# EAGLE design main (EAGLE 8.0.2)
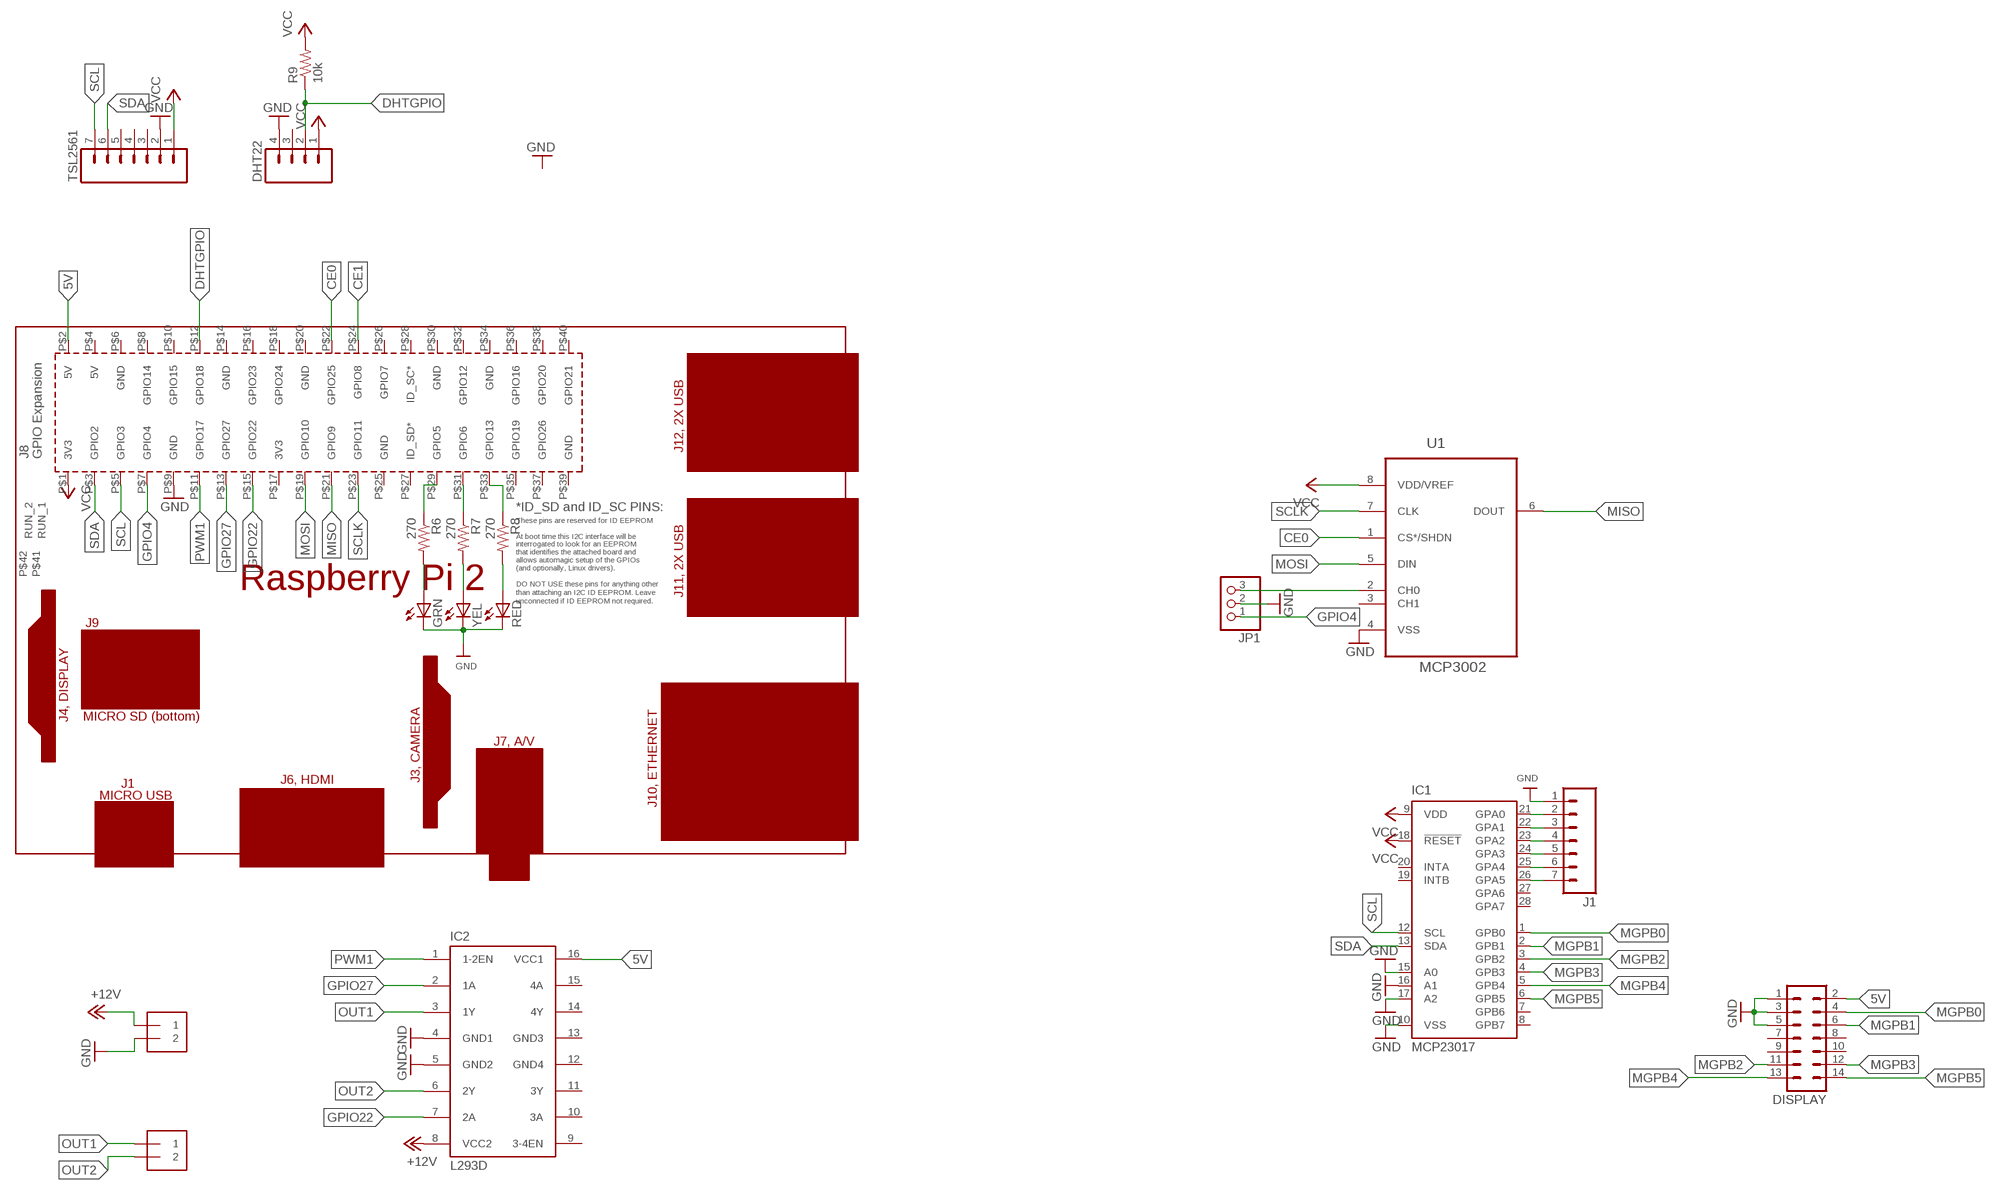
[diagram p0: schematic, sheet 1]

## Parts
DHT22  M041X04_NO_SILK  [1X04_NO_SILK]
DISPLAY  MA07-2  [MA07-2]
GRN  LED3MM  [LED3MM]
IC1  MCP23017  MCP23017SP2  [DIL28-3-ROUND]
IC2  L293D  [DIL16]
J1  M07  [1X07]
J2  1X2-3.5MM  [1X2-3.5MM]
J3  1X2-3.5MM  [1X2-3.5MM]
JP1  PINHD-1X3  [1X03]
PCB1  RPI2  [RPI2]
R6  270  R-US_0204/7  [0204/7]
R7  270  R-US_0204/7  [0204/7]
R8  270  R-US_0204/7  [0204/7]
R9  10k  R-US_0204/7  [0204/7]
RED  LED3MM  [LED3MM]
TSL2561  M07NO_SILK  [1X07_NO_SILK]
U1  MCP3002  MCP3002-I/P  [DIP254P762X533-8]
YEL  LED3MM  [LED3MM]

## Nets
5V: DISPLAY.2 IC2.16(VCC1) PCB1.P$2(5V)
+12V: IC2.8(VCC2) J2.1
CE0: PCB1.P$22(GPIO25) U1.1(CS*/SHDN)
CE1: PCB1.P$24(GPIO8)
DHTGPIO: DHT22.2 PCB1.P$12(GPIO18) R9.1
GND: DHT22.4 DISPLAY.1 DISPLAY.3 DISPLAY.5 GRN.K(C) IC1.10(VSS) IC1.15(A0) IC1.16(A1) IC1.17(A2) IC2.4(GND1) IC2.5(GND2) J1.1 J2.2 JP1.2 PCB1.P$9(GND) RED.K(C) TSL2561.2 U1.4(VSS) YEL.K(C)
GPIO4: JP1.1 PCB1.P$7(GPIO4)
GPIO5: PCB1.P$29(GPIO5) R6.1
GPIO6: PCB1.P$31(GPIO6) R7.1
GPIO13: PCB1.P$33(GPIO13) R8.1
GPIO22: IC2.7(2A) PCB1.P$15(GPIO22)
GPIO27: IC2.2(1A) PCB1.P$13(GPIO27)
MGPB0: DISPLAY.4 IC1.1(GPB0)
MGPB1: DISPLAY.6 IC1.2(GPB1)
MGPB2: DISPLAY.11 IC1.3(GPB2)
MGPB3: DISPLAY.12 IC1.4(GPB3)
MGPB4: DISPLAY.13 IC1.5(GPB4)
MGPB5: DISPLAY.14 IC1.6(GPB5)
MISO: PCB1.P$21(GPIO9) U1.6(DOUT)
MOSI: PCB1.P$19(GPIO10) U1.5(DIN)
N$1: IC1.26(GPA5) J1.7
N$2: IC1.25(GPA4) J1.6
N$3: IC1.24(GPA3) J1.5
N$4: IC1.23(GPA2) J1.4
N$5: IC1.22(GPA1) J1.3
N$6: JP1.3 U1.2(CH0)
N$7: IC1.21(GPA0) J1.2
N$18: GRN.A R6.2
N$19: R7.2 YEL.A
N$20: R8.2 RED.A
OUT1: IC2.3(1Y) J3.1
OUT2: IC2.6(2Y) J3.2
PWM1: IC2.1(1-2EN) PCB1.P$11(GPIO17)
SCL: IC1.12(SCL) PCB1.P$5(GPIO3) TSL2561.7
SCLK: PCB1.P$23(GPIO11) U1.7(CLK)
SDA: IC1.13(SDA) PCB1.P$3(GPIO2) TSL2561.6
VCC: DHT22.1 IC1.9(VDD) IC1.18(!RESET) PCB1.P$1(3V3) R9.2 TSL2561.1 U1.8(VDD/VREF)
Unconnected: DHT22.3 DISPLAY.7 DISPLAY.8 DISPLAY.9 DISPLAY.10 IC1.7(GPB6) IC1.8(GPB7) IC1.19(INTB) IC1.20(INTA) IC1.27(GPA6) IC1.28(GPA7) IC2.9(3-4EN) IC2.10(3A) IC2.11(3Y) IC2.14(4Y) IC2.15(4A) PCB1.P$4(5V) PCB1.P$6(GND) PCB1.P$8(GPIO14) PCB1.P$10(GPIO15) PCB1.P$14(GND) PCB1.P$16(GPIO23) PCB1.P$17(3V3) PCB1.P$18(GPIO24) PCB1.P$20(GND) PCB1.P$25(GND) PCB1.P$26(GPIO7) PCB1.P$27(ID_SD*) PCB1.P$28(ID_SC*) PCB1.P$30(GND) PCB1.P$32(GPIO12) PCB1.P$34(GND) PCB1.P$35(GPIO19) PCB1.P$36(GPIO16) PCB1.P$37(GPIO26) PCB1.P$38(GPIO20) PCB1.P$39(GND) PCB1.P$40(GPIO21) PCB1.P$41(RUN_1) PCB1.P$42(RUN_2) TSL2561.3 TSL2561.4 TSL2561.5 U1.3(CH1)

## Power pins joined to a net without a drawn wire
GND3: IC2.13(GND3)
GND4: IC2.12(GND4)

## Library data of the parts
DHT22 = SparkFun-Connectors:M04: Header 4 Standard 4-pin 0.1" header. Use with straight break away headers (SKU : PRT-00116), right angle break away headers (PRT-00553), swiss pins (PRT-00743), machine pins (PRT-00117), and female headers (PRT-00115). Molex polarized connector foot print use with SKU : PRT-08231 with associated crimp pins and housings. 1MM SMD Version SKU: PRT-10208; PROD_ID: CONN-09696
DISPLAY = con-lstb:MA07-2: PIN HEADER; OC_FARNELL: unknown; OC_NEWARK: unknown
GRN RED YEL = adafruit:LED: LED OSRAM: - CHIPLED LG R971, LG N971, LY N971, LG Q971, LY Q971, LO R971, LY R971 LH N974, LH R974 LS Q976, LO Q976, LY Q976 LO Q996 - Hyper CHIPLED LW Q18S LB Q993, LB Q99A, LB R99A - SideLED LS A670, LO A670, LY A670, LG A670, LP A670 LB A673, LV A673, LT A673, LW A673 LH A674 LY A675 LS A676, LA A676, LO A676, LY A676, LW A676 LS A679, LY A679, LG A679 - Hyper Micro SIDELED® LS Y876, LA Y876, LO Y876, LY Y876 LT Y87S - SmartLED LW L88C, LW L88S LB L89C, LB L89S, LG L890 LS L89K, LO L89K, LY L89K LS L896, LA L896, LO L896, LY L896 - TOPLED LS T670, LO T670, LY T670, LG T670, LP T670 LSG T670, LSP T670, LSY T670, LOP T670, LYG T670 LG T671, LOG T671, LSG T671 LB T673, LV T673, LT T673, LW T673 LH T674 LS T676, LA T676, LO T676, LY T676, LB T676, LH T676, LSB T676, LW T676 LB T67C, LV T67C, LT T67C, LS T67K, LO T67K, LY T67K, LW E67C LS E67B, LA E67B, LO E67B, LY E67B, LB E67C, LV E67C, LT E67C LW T67C LS T679, LY T679, LG T679 LS T770, LO T770, LY T770, LG T770, LP T770 LB T773, LV T773, LT T773, LW T773 LH T774 LS E675, LA E675, LY E675, LS T675 LS T776, LA T776, LO T776, LY T776, LB T776 LHGB T686 LT T68C, LB T68C - Hyper Mini TOPLED® LB M676 - Mini TOPLED Santana® LG M470 LS M47K, LO M47K, LY M47K Source: http://www.osram.convergy.de/
IC1 = adafruit:MCP23017: http://ww1.microchip.com/downloads/en/DeviceDoc/21952a.pdf Source: http://ww1.microchip.com/downloads/en/DeviceDoc/21952a.pdf
IC2 = st-microelectronics:L293D: PUSH-PULL 4 CHANNEL DRIVER; MPN: L293D; OC_FARNELL: 9589619; OC_NEWARK: 56P8249
J1 TSL2561 = SparkFun-Connectors:M07: Header 7 Standard 7-pin 0.1" header. Use with straight break away headers (SKU : PRT-00116), right angle break away headers (PRT-00553), swiss pins (PRT-00743), machine pins (PRT-00117), and female headers (PRT-00115). NOTES ON THE VARIANTS LOCK and LOCK_LONGPADS... This footprint was designed to help hold the alignment of a through-hole component (i.e. 7-pin header) while soldering it into place. You may notice that each hole has been shifted either up or down by 0.005 of an inch from it's more standard position (which is usually a perfectly straight line). This slight alteration caused the pins (the squares in the middle) to touch the edges of the holes. Because they are alternating, it causes a "brace" to hold the header in place. 0.005 has proven to be the perfect amount of "off-center" position when using our standard breakaway headers. Although looks a little odd when you look at the bare footprint, once you have a header in there, the alteration is very hard to notice. Also, if you push a header all the way into place, it is covered up entirely on the bottom side. This idea of altering the position of holes to aid alignment will be further integrated into the Sparkfun Library for other footprints. It can help hold any component with 3 or more connection pins.
J2 J3 = adafruit:1X2: 3.5mm Terminal block http://www.ladyada.net/library/pcb/eaglelibrary.html
JP1 = adafruit:PINHD-1X3: PIN HEADER
PCB1 = e14_Rpi2_RevA:RPI2: Device for Raspberry Pi 2 board created by www.element14.com More information and support community is available at http://www.element14.com/community/community/raspberry-pi/raspberrypi2
R6-R9 = adafruit:R-US_: RESISTOR, American symbol
U1 = mcp:MCP3002-I/P: IC, ADC, 10BIT, 200KSPS, DIP-8; MPN: MCP3002-I/P; OC_FARNELL: 1852015; OC_NEWARK: 61K2948; PACKAGE: DIP-8; SUPPLIER: Microchip

## Board
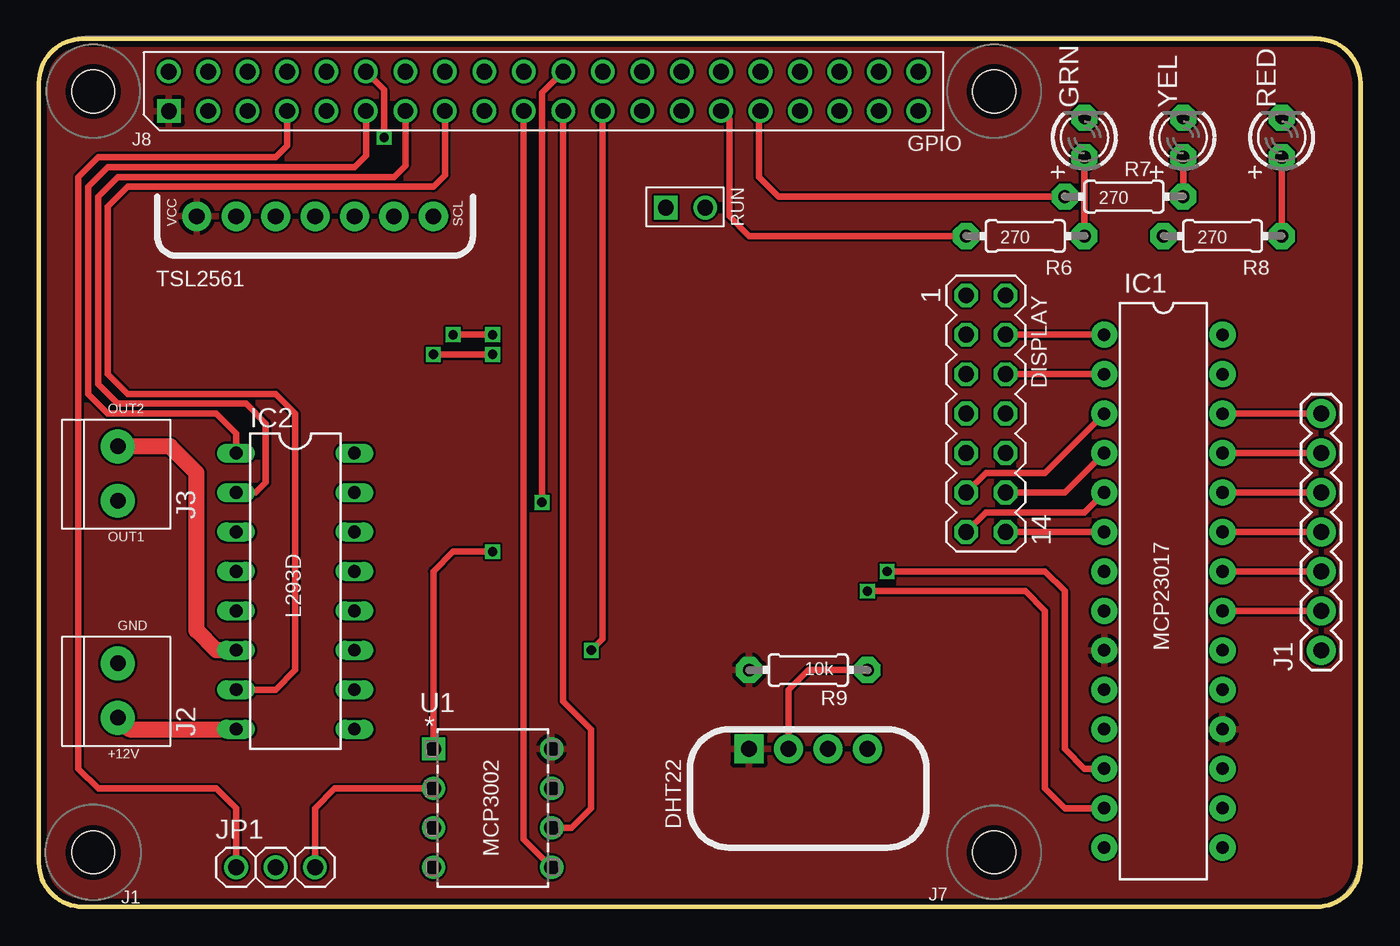
[diagram p1: board, top side]
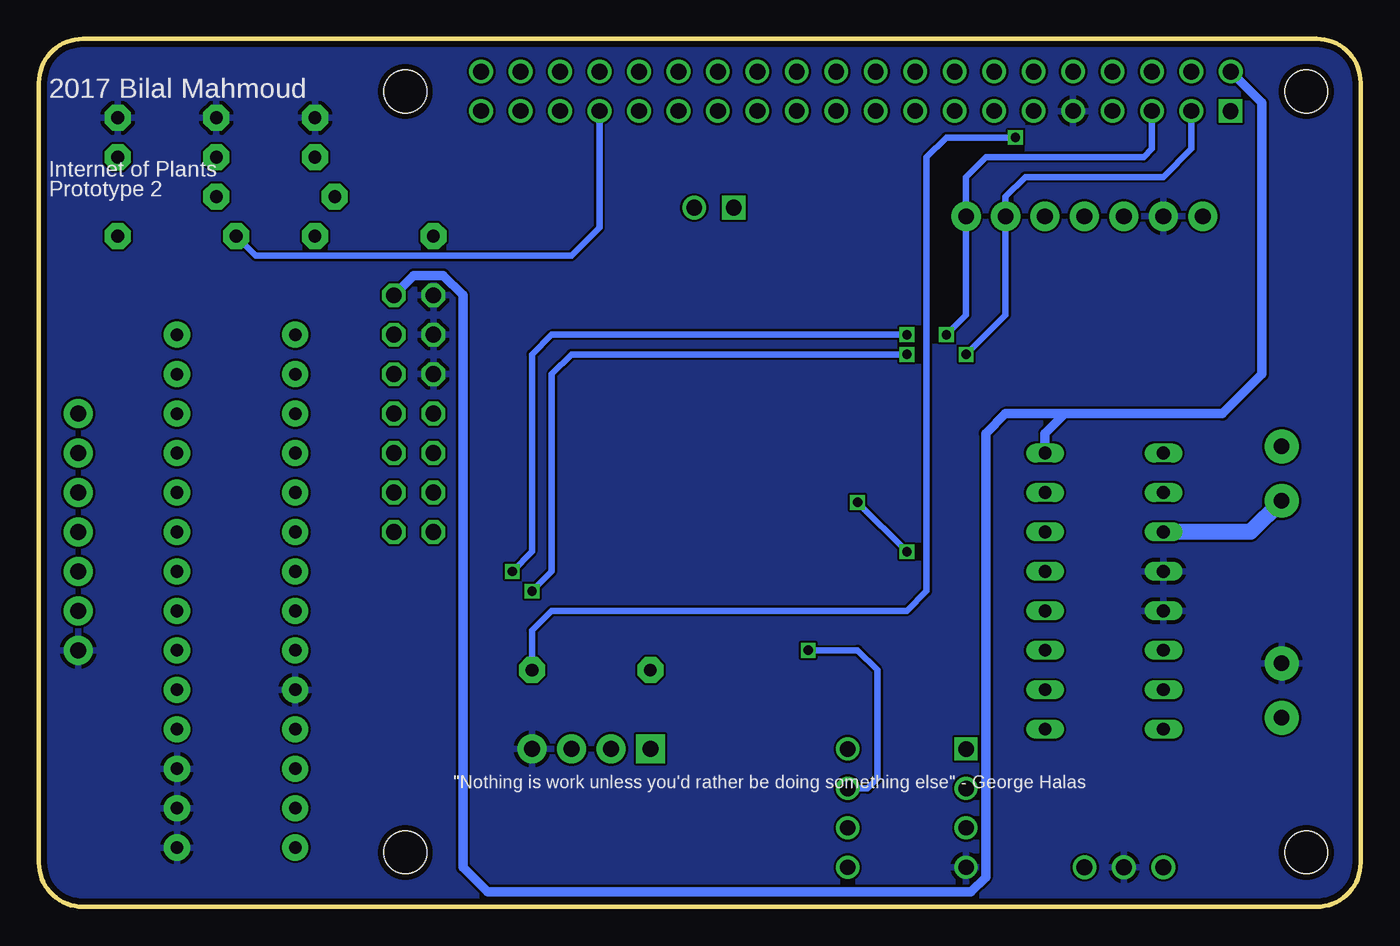
[diagram p2: board, bottom side, seen from below]

Size 85.09 x 55.88 mm. Coordinates in mm from the lower left corner, seen from the top.
Copper layers (1*16): Top 0.0356mm / dielectric 1.5011mm / Bottom 0.0356mm
Design rules "PCBs_io": minimum track width 6mil, minimum drill 13mil, track to track 6mil, track to pad 6mil, pad to pad 6mil, via to via 6mil, smd to smd 6mil, copper to edge 15mil, drill to drill 6mil, minimum pad ring 7mil, minimum via ring 7mil, stop-mask expansion 3mil, vias tented up to drill 0mil, thermal gap 10mil

### Footprints (pad centres in the part's own frame; a part is rotated, then mirrored left to right if it is on the bottom)
1X04_NO_SILK = drill 1.016 pad 1.88 square: 1 0,0 | drill 1.016 pad 1.88: 2 2.54,0; 3 5.08,0; 4 7.62,0
MA07-2 = drill 1.016 octagon: 1 -7.62,-1.27; 2 -7.62,1.27; 3 -5.08,-1.27; 4 -5.08,1.27; 5 -2.54,-1.27; 6 -2.54,1.27; 7 0,-1.27; 8 0,1.27; 9 2.54,-1.27; 10 2.54,1.27; 11 5.08,-1.27; 12 5.08,1.27; 13 7.62,-1.27; 14 7.62,1.27
LED3MM = drill 0.813 pad 1.676 octagon: A -1.27,0; K 1.27,0
DIL28-3-ROUND = drill 0.813 pad 1.676: 1 -16.51,-3.81; 2 -13.97,-3.81; 3 -11.43,-3.81; 4 -8.89,-3.81; 5 -6.35,-3.81; 6 -3.81,-3.81; 7 -1.27,-3.81; 8 1.27,-3.81; 9 3.81,-3.81; 10 6.35,-3.81; 11 8.89,-3.81; 12 11.43,-3.81; 13 13.97,-3.81; 14 16.51,-3.81; 15 16.51,3.81; 16 13.97,3.81; 17 11.43,3.81; 18 8.89,3.81; 19 6.35,3.81; 20 3.81,3.81; 21 1.27,3.81; 22 -1.27,3.81; 23 -3.81,3.81; 24 -6.35,3.81; 25 -8.89,3.81; 26 -11.43,3.81; 27 -13.97,3.81; 28 -16.51,3.81
DIL16 = drill 0.813 long: 1 -8.89,-3.81; 2 -6.35,-3.81; 3 -3.81,-3.81; 4 -1.27,-3.81; 5 1.27,-3.81; 6 3.81,-3.81; 7 6.35,-3.81; 8 8.89,-3.81; 9 8.89,3.81; 10 6.35,3.81; 11 3.81,3.81; 12 1.27,3.81; 13 -1.27,3.81; 14 -3.81,3.81; 15 -6.35,3.81; 16 -8.89,3.81
1X07 = drill 1.016 pad 1.88: 1 0,0; 2 2.54,0; 3 5.08,0; 4 7.62,0; 5 10.16,0; 6 12.7,0; 7 15.24,0
1X2-3.5MM = drill 1 pad 2.184: 1 1.8,0; 2 -1.7,0
1X03 = drill 1.016: 1 -2.54,0; 2 0,0; 3 2.54,0
RPI2 = drill 1.016 square: P$1 8.37,51.23; P$41 40.36,45.01 | drill 1.016: P$2 8.357,53.772; P$3 10.897,51.232; P$4 10.897,53.772; P$5 13.437,51.232; P$6 13.437,53.772; P$7 15.977,51.232; P$8 15.977,53.772; P$9 18.517,51.232; P$10 18.517,53.772; P$11 21.057,51.232; P$12 21.057,53.772; P$13 23.597,51.232; P$14 23.597,53.772; P$15 26.137,51.232; P$16 26.137,53.772; P$17 28.677,51.232; P$18 28.677,53.772; P$19 31.217,51.232; P$20 31.217,53.772; P$21 33.757,51.232; P$22 33.757,53.772; P$23 36.297,51.232; P$24 36.297,53.772; P$25 38.837,51.232; P$26 38.837,53.772; P$27 41.377,51.232; P$28 41.377,53.772; P$29 43.917,51.232; P$30 43.917,53.772; P$31 46.457,51.232; P$32 46.457,53.772; P$33 48.997,51.232; P$34 48.997,53.772; P$35 51.537,51.232; P$36 51.537,53.772; P$37 54.077,51.232; P$38 54.077,53.772; P$39 56.617,51.232; P$40 56.617,53.772; P$42 42.9,45.01 | hole 2.75: 3.5,3.5; 61.5,3.5; 3.5,52.5; 61.5,52.5
0204/7 = drill 0.813 pad 1.676 octagon: 1 -3.81,0; 2 3.81,0
1X07_NO_SILK = drill 1.016 pad 1.88: 1 0,0; 2 2.54,0; 3 5.08,0; 4 7.62,0; 5 10.16,0; 6 12.7,0; 7 15.24,0
DIP254P762X533-8 = drill 0.991 square: 1 -7.62,7.62 | drill 0.991: 2 -7.62,5.08; 3 -7.62,2.54; 4 -7.62,0; 5 0,0; 6 0,2.54; 7 0,5.08; 8 0,7.62

### Placement (x,y rotation side)
DHT22  45.72,10.16 0 top
DISPLAY  60.96,31.75 270 top
GRN  67.31,49.53 90 top
IC1  72.39,20.32 270 top
IC2  16.51,20.32 270 top
J1  82.55,16.51 90 top
J2  5.08,13.97 270 top
J3  5.08,27.94 270 top
JP1  15.24,2.54 0 top
PCB1  0,0 0 top
R6  63.5,43.18 0 top
R7  69.85,45.72 0 top
R8  76.2,43.18 0 top
R9  49.53,15.24 180 top
RED  80.01,49.53 90 top
TSL2561  10.16,44.45 0 top
U1  33.02,2.54 0 top
YEL  73.66,49.53 90 top

### Tracks (layer width: path | path; a pad name or v marks a point on that pad's centre or on a via)
5V
  Bottom 0.61: PCB1.P$2 6.35,51.77 6.35,34.29 8.89,31.75 19.05,31.75 | 19.05,31.75 20.32,30.48 IC2.16 | 19.05,31.75 22.86,31.75 24.13,30.48 24.13,1.91 25.08,0.95 56.2,0.95 57.78,2.54 57.78,39.37 59.05,40.64 60.96,40.64 DISPLAY.2
+12V
  Top 1.016: J2.1 5.82,11.43 IC2.8
CE0  (via drill 0.6)
  Top 0.406: v29.21,22.86 26.67,22.86 25.4,21.59 U1.1 | PCB1.P$22 32.38,52.4 v32.38,26.04
  Bottom 0.406: v32.38,26.04 v29.21,22.86
DHTGPIO  (via drill 0.6)
  Top 0.406: R9.1 49.53,15.24 48.26,13.97 DHT22.2 | PCB1.P$12 22.23,52.6 v22.23,49.53
  Bottom 0.406: v22.23,49.53 26.67,49.53 27.94,48.26 27.94,20.32 29.21,19.05 52.07,19.05 53.34,17.78 R9.1
GND
  pour Bottom: 0,0 85.09,0 85.09,55.88 0,55.88
GPIO4
  Top 0.406: PCB1.P$7 15.98,49 15.24,48.26 3.81,48.26 2.54,46.99 2.54,8.89 3.81,7.62 11.43,7.62 12.7,6.35 JP1.1
GPIO5
  Top 0.406: PCB1.P$29 44.45,50.7 44.45,44.45 45.72,43.18 R6.1
GPIO6
  Top 0.406: R7.1 47.62,45.72 46.35,46.99 46.35,51.13 PCB1.P$31
GPIO13
  Bottom 0.406: R8.1 71.12,41.91 50.8,41.91 49,43.71 PCB1.P$33
GPIO22
  Top 0.406: PCB1.P$15 26.14,47.09 25.4,46.35 5.71,46.35 4.45,45.09 4.45,34.29 5.71,33.02 15.24,33.02 16.51,31.75 16.51,15.24 15.24,13.97 IC2.7
GPIO27
  Top 0.406: PCB1.P$13 23.6,47.73 22.86,46.99 5.08,46.99 3.81,45.72 3.81,33.66 5.08,32.38 13.34,32.38 14.61,31.11 14.61,27.3 13.97,26.67 IC2.2
MGPB0
  Top 0.406: DISPLAY.4 IC1.1
MGPB1
  Top 0.406: DISPLAY.6 IC1.2
MGPB2
  Top 0.406: DISPLAY.11 60.96,27.94 64.77,27.94 IC1.3
MGPB3
  Top 0.406: IC1.4 66.04,26.67 DISPLAY.12
MGPB4
  Top 0.406: DISPLAY.13 60.96,25.4 67.31,25.4 IC1.5
MGPB5
  Top 0.406: DISPLAY.14 IC1.6
MISO
  Top 0.406: PCB1.P$21 33.76,13.23 35.56,11.43 35.56,6.35 34.29,5.08 U1.6
MOSI
  Top 0.406: PCB1.P$19 31.22,4.34 U1.5
N$1
  Top 0.406: IC1.26 J1.7
N$2
  Top 0.406: IC1.25 J1.6
N$3
  Top 0.406: IC1.24 J1.5
N$4
  Top 0.406: IC1.23 J1.4
N$5
  Top 0.406: IC1.22 J1.3
N$6
  Top 0.406: JP1.3 17.78,6.35 19.05,7.62 U1.2
N$7
  Top 0.406: IC1.21 J1.2
N$18
  Top 0.406: R6.2 GRN.A
N$19
  Top 0.406: R7.2 YEL.A
N$20
  Top 0.406: R8.2 RED.A
OUT1
  Bottom 1.016: J3.1 7.09,24.13 IC2.3
OUT2
  Top 1.016: IC2.6 11.43,16.51 10.16,17.78 10.16,27.94 8.46,29.64 J3.2
PWM1
  Top 0.406: PCB1.P$11 21.06,48.36 20.32,47.62 4.45,47.62 3.17,46.35 3.17,33.02 4.45,31.75 11.43,31.75 12.7,30.48 IC2.1
SCL  (via drill 0.6)
  Top 0.406: v26.67,36.83 v29.21,36.83 | v54.61,21.59 64.77,21.59 66.04,20.32 66.04,10.16 67.31,8.89 IC1.12
  Bottom 0.406: PCB1.P$5 13.44,48.79 13.97,48.26 24.13,48.26 25.4,46.99 TSL2561.7 25.4,38.1 v26.67,36.83 | v29.21,36.83 52.07,36.83 53.34,35.56 53.34,22.86 v54.61,21.59
SCLK  (via drill 0.6)
  Top 0.406: PCB1.P$23 36.3,17.25 v35.56,16.51
  Bottom 0.406: v35.56,16.51 32.38,16.51 31.11,15.24 31.11,8.26 31.75,7.62 U1.7
SDA  (via drill 0.6)
  Top 0.406: v25.4,35.56 v29.21,35.56 | v53.34,20.32 63.5,20.32 64.77,19.05 64.77,7.62 66.04,6.35 IC1.13
  Bottom 0.406: PCB1.P$3 10.9,48.79 12.7,46.99 21.59,46.99 22.86,45.72 TSL2561.6 22.86,38.1 v25.4,35.56 | v53.34,20.32 52.07,21.59 52.07,34.29 50.8,35.56 v29.21,35.56
VCC
  pour Top: 0,0 85.09,0 85.09,55.88 0,55.88

### Text on the board
tPlace: VCC | SCL
bPlace: 2017 Bilal Mahmoud | Internet of Plants | Prototype 2
tNames: OUT2 | OUT1 | GND | +12V
bNames: "Nothing is work unless you'd rather be doing something else" - George Halas